# Altium schematic sheet USB.SchDoc
size A4; SheetNumber: 9; SheetTotal: 13
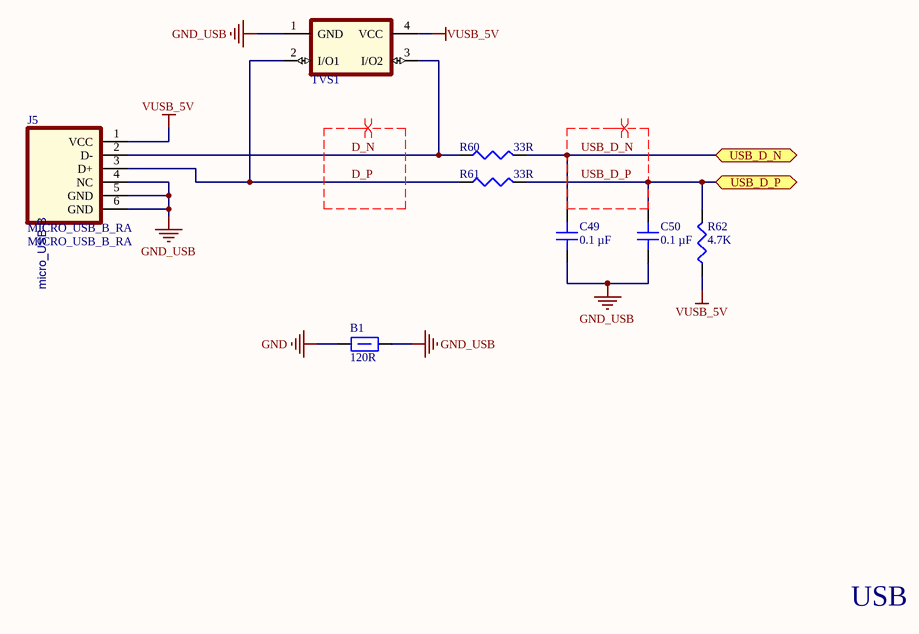
[diagram p0: USB.SchDoc]

## Parts
B1  value 120R  [F0603]  (hidden comment: BEAD FERRITE 120R 1LN SMD 0603)
C49  0.1 µF  [CAP 0603_1608]
C50  0.1 µF  [CAP 0603_1608]
J5  MICRO_USB_B_RA  [MICRO_USB_B]
R60  33R  [R 0603(1608)]
R61  33R  [R 0603(1608)]
R62  4.7K  [R 0603(1608)]
TVS1  TVS DIODE PRTR5V0U2X,215 5.5VWM 6V SOT143  [SOT143]  (value not drawn)

## Ports
USB_D_N (bidir), USB_D_P (bidir)

## Nets
GND: B1.1
GND_USB: B1.2 C49.1 C50.1 J5.4(NC) J5.5(GND) J5.6(GND) TVS1.1(GND)
VUSB_5V: J5.1(VCC) R62.2 TVS1.4(VCC)
D_N: J5.2(D-) R60.2 TVS1.3(I/O2)
D_P: J5.3(D+) R61.2 TVS1.2(I/O1)
USB_D_N: C49.2 R60.1 ; port USB_D_N
USB_D_P: C50.2 R61.1 R62.1 ; port USB_D_P

## Layout directives
differential pair; differential pair class 90ohm: D_N, D_P, USB_D_N, USB_D_P

## Notes on the sheet
- USB
- (in symbol MICRO_USB_B_RA) micro_USB-B

## Library data of the parts
B1 = BEAD FERRITE 120R 1LN SMD 0603: Manufacturer: MURATA; Manufacturer Part Name: BLM18PG121SN1D; Code: 3030007; Family: BEAD; Supplier: Digikey; Supplier No: 490-1037-2-ND; Package Reference: F1206
C49 C50 = 0603BB104K500NGT: CAP CER 0.1UF 50V X7R 0603; Part Number: 0603BB104K500NGT; Value: 0.1 µF
J5 = MICRO_USB_B_RA: CONN MICRO B USB 2.0 RECEPTACLE 5POS SMD RA; Manufacturer: AMPHENOL; Manufacturer Part Name: 10118194-0001LF; Code: 3050016; Family: CONN; Supplier: Digikey; Supplier No: 609-4618-2-ND; Value: MICRO_USB_B_RA
R60 R61 = Res3: Res Thick Film 0603 33 Ohm 1% 1/10W +/-100ppm/ßC Molded SMD Paper T/R; Manufacturer: Yageo; Manufacturer Part Number: RC0603FR-0733RL; Temperature Coefficient: 100ppm/°C; Voltage Rating (DC): 50V; Power Rating: 100mW; Voltage Rating: 75V; ComponentLink1URL: https://datasheet.ciiva.com/11819/0900766b80c66297-11819477.pdf?src-supplier=RSComponents; ComponentLink1Description: https://datasheet.ciiva.com/11819/0900766b80c66297-11819477.pdf?src-supplier=RSComponents; ComponentLink2URL: https://datasheet.ciiva.com/12666/pyu-rc0402-51-rohs-l-6-r-12666741.pdf?src-supplier=Mouser; ComponentLink2Description: https://datasheet.ciiva.com/12666/pyu-rc0402-51-rohs-l-6-r-12666741.pdf?src-supplier=Mouser; ComponentLink3URL: https://datasheet.ciiva.com/17063/pyu-rc0402-51-rohs-l-6-r-17063193.pdf?src-supplier=Future+Electronics; ComponentLink3Description: https://datasheet.ciiva.com/17063/pyu-rc0402-51-rohs-l-6-r-17063193.pdf?src-supplier=Future+Electronics; ComponentLink4URL: https://datasheet.ciiva.com/22747/1018594-22747513.pdf?src-supplier=Element14; ComponentLink4Description: https://datasheet.ciiva.com/22747/1018594-22747513.pdf?src-supplier=Element14; ComponentLink5URL: https://datasheet.ciiva.com/7849/1018594-7849869.pdf?src-supplier=Element14; ComponentLink5Description: https://datasheet.ciiva.com/7849/1018594-7849869.pdf?src-supplier=Element14; ComponentLink6URL: https://datasheet.ciiva.com/7983/1018594-7983502.pdf?src-supplier=Element14; ComponentLink6Description: https://datasheet.ciiva.com/7983/1018594-7983502.pdf?src-supplier=Element14; ComponentLink7URL: https://datasheet.ciiva.com/7849/1018594-7849871.pdf?src-supplier=Element14; ComponentLink7Description: https://datasheet.ciiva.com/7849/1018594-7849871.pdf?src-supplier=Element14; ComponentLink8URL: https://datasheet.ciiva.com/11808/0900766b80c66297-11808195.pdf?src-supplier=RSComponents; ComponentLink8Description: https://datasheet.ciiva.com/11808/0900766b80c66297-11808195.pdf?src-supplier=RSComponents; ComponentLink9URL: https://datasheet.ciiva.com/2452/pyu-rc0402-51-rohs-l-6-2452608.pdf?src-supplier=Digi-Key; ComponentLink9Description: https://datasheet.ciiva.com/2452/pyu-rc0402-51-rohs-l-6-2452608.pdf?src-supplier=Digi-Key; ComponentLink10URL: https://datasheet.ciiva.com/2452/pyu-r-int-thick-7-2452609.pdf?src-supplier=Digi-Key; ComponentLink10Description: https://datasheet.ciiva.com/2452/pyu-r-int-thick-7-2452609.pdf?src-supplier=Digi-Key; ComponentLink11URL: https://datasheet.ciiva.com/2452/pyu-r-int-thick-7-2452610.pdf?src-supplier=Digi-Key; ComponentLink11Description: https://datasheet.ciiva.com/2452/pyu-r-int-thick-7-2452610.pdf?src-supplier=Digi-Key; ComponentLink12URL: https://datasheet.ciiva.com/28386/pyu-rc0402-51-rohs-l-6-28386633.pdf?src-supplier=Avnet+Europe; ComponentLink12Description: https://datasheet.ciiva.com/28386/pyu-rc0402-51-rohs-l-6-28386633.pdf?src-supplier=Avnet+Europe; ComponentLink13URL: https://datasheet.ciiva.com/22747/1018594-22747515.pdf?src-supplier=Element14; ComponentLink13Description: https://datasheet.ciiva.com/22747/1018594-22747515.pdf?src-supplier=Element14; ComponentLink14URL: https://datasheet.ciiva.com/7983/1018594-7983535.pdf?src-supplier=Element14; ComponentLink14Description: https://datasheet.ciiva.com/7983/1018594-7983535.pdf?src-supplier=Element14; ComponentLink15URL: https://datasheet.ciiva.com/8896/pyu-rc0402-51-rohs-l-6-8896201.pdf?src-supplier=Avnet; ComponentLink15Description: https://datasheet.ciiva.com/8896/pyu-rc0402-51-rohs-l-6-8896201.pdf?src-supplier=Avnet; ComponentLink16URL: https://datasheet.ciiva.com/15189/getdatasheetpartid-326379-15189533.pdf?src-supplier=Verical; ComponentLink16Description: https://datasheet.ciiva.com/15189/getdatasheetpartid-326379-15189533.pdf?src-supplier=Verical; Supplier 1: Digi-Key; Supplier Part Number 1: 311-33.0HRCT-ND; RoHS: Yes; Category: Chip SMD Resistors; Stock 1: 1329282; Pricing 1: 1=0,10000, 10=0,02400, 100=0,00970, 1000=0,00436, 2500=0,00378 (USD); Case/Package: 0603; Number of Pins: 2; Case Code (Metric): 1608; Case Code (Imperial): 0603; Weight: 7.1E-05oz; Size Code: 0603; Min Operating Temperature: -55°C; Max Operating Temperature: 155°C; Resistance: 33R; Tolerance: 1%; Resistor Type: Thick Film; Packaging: Tape and Reel; Package Quantity: 1; Number of Terminations: 2; Termination: SMD/SMT; Max Power Dissipation: 100mW; Features: Moisture Resistant; Series: RC; Resistance Tolerance: 1%; Technology: THICK FILM; Construction: Rectangular; Length: 1.6mm; Width: 0.8mm; Height: 0.45mm; Depth: 0.8mm; Lead Pitch: 0.3mm; REACH SVHC: No SVHC; Lead Free: Lead Free; Military Standard: Not; RoHS Compliant: Yes; ComponentLink17URL: https://datasheet.ciiva.com/11808/0900766b80f96399-11808741.pdf?src-supplier=RSComponents; ComponentLink17Description: https://datasheet.ciiva.com/11808/0900766b80f96399-11808741.pdf?src-supplier=RSComponents; ComponentLink18URL: https://datasheet.ciiva.com/2453/pyu-r-int-thick-7-2453952.pdf?src-supplier=Digi-Key; ComponentLink18Description: https://datasheet.ciiva.com/2453/pyu-r-int-thick-7-2453952.pdf?src-supplier=Digi-Key; ComponentLink19URL: https://datasheet.ciiva.com/2453/pyu-r-int-thick-7-2453953.pdf?src-supplier=Digi-Key; ComponentLink19Description: https://datasheet.ciiva.com/2453/pyu-r-int-thick-7-2453953.pdf?src-supplier=Digi-Key; ComponentLink20URL: https://datasheet.ciiva.com/2453/pyu-r-int-thick-7-2453954.pdf?src-supplier=Digi-Key; ComponentLink20Description: https://datasheet.ciiva.com/2453/pyu-r-int-thick-7-2453954.pdf?src-supplier=Digi-Key; ComponentLink21URL: https://datasheet.ciiva.com/7660/38590-7660792.pdf?src-supplier=Element14; ComponentLink21Description: https://datasheet.ciiva.com/7660/38590-7660792.pdf?src-supplier=Element14; ComponentLink22URL: https://datasheet.ciiva.com/15189/getdatasheetpartid-326673-15189708.pdf?src-supplier=Verical; ComponentLink22Description: https://datasheet.ciiva.com/15189/getdatasheetpartid-326673-15189708.pdf?src-supplier=Verical; ComponentLink23URL: https://datasheet.ciiva.com/7746/443971-7746334.pdf?src-supplier=Element14; ComponentLink23Description: https://datasheet.ciiva.com/7746/443971-7746334.pdf?src-supplier=Element14; ComponentLink24URL: https://datasheet.ciiva.com/7746/443971-7746335.pdf?src-supplier=Element14; ComponentLink24Description: https://datasheet.ciiva.com/7746/443971-7746335.pdf?src-supplier=Element14; ComponentLink25URL: https://datasheet.ciiva.com/46395/443971-46395007.pdf?src-supplier=Element14; ComponentLink25Description: https://datasheet.ciiva.com/46395/443971-46395007.pdf?src-supplier=Element14
R62 = Res3: Res Thick Film 0603 4.7K Ohm 5% 0.1W(1/10W) ±100ppm/C Molded SMD Paper T/R; Manufacturer: Yageo; Manufacturer Part Number: RC0603JR-074K7L; Resistance: 4.7kR; Temperature Coefficient: 100ppm/°C; Voltage Rating (DC): 50V; Power Rating: 100mW; ComponentLink1URL: https://datasheet.ciiva.com/11819/0900766b80c66297-11819477.pdf?src-supplier=RSComponents; ComponentLink1Description: https://datasheet.ciiva.com/11819/0900766b80c66297-11819477.pdf?src-supplier=RSComponents; ComponentLink2URL: https://datasheet.ciiva.com/12666/pyu-rc0402-51-rohs-l-6-r-12666741.pdf?src-supplier=Mouser; ComponentLink2Description: https://datasheet.ciiva.com/12666/pyu-rc0402-51-rohs-l-6-r-12666741.pdf?src-supplier=Mouser; ComponentLink3URL: https://datasheet.ciiva.com/17063/pyu-rc0402-51-rohs-l-6-r-17063193.pdf?src-supplier=Future+Electronics; ComponentLink3Description: https://datasheet.ciiva.com/17063/pyu-rc0402-51-rohs-l-6-r-17063193.pdf?src-supplier=Future+Electronics; ComponentLink4URL: https://datasheet.ciiva.com/22747/1018594-22747513.pdf?src-supplier=Element14; ComponentLink4Description: https://datasheet.ciiva.com/22747/1018594-22747513.pdf?src-supplier=Element14; ComponentLink5URL: https://datasheet.ciiva.com/7849/1018594-7849869.pdf?src-supplier=Element14; ComponentLink5Description: https://datasheet.ciiva.com/7849/1018594-7849869.pdf?src-supplier=Element14; ComponentLink6URL: https://datasheet.ciiva.com/7983/1018594-7983502.pdf?src-supplier=Element14; ComponentLink6Description: https://datasheet.ciiva.com/7983/1018594-7983502.pdf?src-supplier=Element14; ComponentLink7URL: https://datasheet.ciiva.com/7849/1018594-7849871.pdf?src-supplier=Element14; ComponentLink7Description: https://datasheet.ciiva.com/7849/1018594-7849871.pdf?src-supplier=Element14; ComponentLink8URL: https://datasheet.ciiva.com/11808/0900766b80c66297-11808195.pdf?src-supplier=RSComponents; ComponentLink8Description: https://datasheet.ciiva.com/11808/0900766b80c66297-11808195.pdf?src-supplier=RSComponents; ComponentLink9URL: https://datasheet.ciiva.com/2452/pyu-rc0402-51-rohs-l-6-2452608.pdf?src-supplier=Digi-Key; ComponentLink9Description: https://datasheet.ciiva.com/2452/pyu-rc0402-51-rohs-l-6-2452608.pdf?src-supplier=Digi-Key; ComponentLink10URL: https://datasheet.ciiva.com/2452/pyu-r-int-thick-7-2452609.pdf?src-supplier=Digi-Key; ComponentLink10Description: https://datasheet.ciiva.com/2452/pyu-r-int-thick-7-2452609.pdf?src-supplier=Digi-Key; ComponentLink11URL: https://datasheet.ciiva.com/2452/pyu-r-int-thick-7-2452610.pdf?src-supplier=Digi-Key; ComponentLink11Description: https://datasheet.ciiva.com/2452/pyu-r-int-thick-7-2452610.pdf?src-supplier=Digi-Key; ComponentLink12URL: https://datasheet.ciiva.com/28386/pyu-rc0402-51-rohs-l-6-28386633.pdf?src-supplier=Avnet+Europe; ComponentLink12Description: https://datasheet.ciiva.com/28386/pyu-rc0402-51-rohs-l-6-28386633.pdf?src-supplier=Avnet+Europe; ComponentLink13URL: https://datasheet.ciiva.com/22747/1018594-22747515.pdf?src-supplier=Element14; ComponentLink13Description: https://datasheet.ciiva.com/22747/1018594-22747515.pdf?src-supplier=Element14; ComponentLink14URL: https://datasheet.ciiva.com/7983/1018594-7983535.pdf?src-supplier=Element14; ComponentLink14Description: https://datasheet.ciiva.com/7983/1018594-7983535.pdf?src-supplier=Element14; ComponentLink15URL: https://datasheet.ciiva.com/8896/pyu-rc0402-51-rohs-l-6-8896201.pdf?src-supplier=Avnet; ComponentLink15Description: https://datasheet.ciiva.com/8896/pyu-rc0402-51-rohs-l-6-8896201.pdf?src-supplier=Avnet; ComponentLink16URL: https://datasheet.ciiva.com/15189/getdatasheetpartid-326379-15189533.pdf?src-supplier=Verical; ComponentLink16Description: https://datasheet.ciiva.com/15189/getdatasheetpartid-326379-15189533.pdf?src-supplier=Verical; ComponentLink17URL: https://datasheet.ciiva.com/11808/0900766b80f96399-11808741.pdf?src-supplier=RSComponents; ComponentLink17Description: https://datasheet.ciiva.com/11808/0900766b80f96399-11808741.pdf?src-supplier=RSComponents; ComponentLink18URL: https://datasheet.ciiva.com/2453/pyu-r-int-thick-7-2453952.pdf?src-supplier=Digi-Key; ComponentLink18Description: https://datasheet.ciiva.com/2453/pyu-r-int-thick-7-2453952.pdf?src-supplier=Digi-Key; ComponentLink19URL: https://datasheet.ciiva.com/2453/pyu-r-int-thick-7-2453953.pdf?src-supplier=Digi-Key; ComponentLink19Description: https://datasheet.ciiva.com/2453/pyu-r-int-thick-7-2453953.pdf?src-supplier=Digi-Key; ComponentLink20URL: https://datasheet.ciiva.com/2453/pyu-r-int-thick-7-2453954.pdf?src-supplier=Digi-Key; ComponentLink20Description: https://datasheet.ciiva.com/2453/pyu-r-int-thick-7-2453954.pdf?src-supplier=Digi-Key; ComponentLink21URL: https://datasheet.ciiva.com/7660/38590-7660792.pdf?src-supplier=Element14; ComponentLink21Description: https://datasheet.ciiva.com/7660/38590-7660792.pdf?src-supplier=Element14; ComponentLink22URL: https://datasheet.ciiva.com/15189/getdatasheetpartid-326673-15189708.pdf?src-supplier=Verical; ComponentLink22Description: https://datasheet.ciiva.com/15189/getdatasheetpartid-326673-15189708.pdf?src-supplier=Verical; ComponentLink23URL: https://datasheet.ciiva.com/7746/443971-7746334.pdf?src-supplier=Element14; ComponentLink23Description: https://datasheet.ciiva.com/7746/443971-7746334.pdf?src-supplier=Element14; ComponentLink24URL: https://datasheet.ciiva.com/7746/443971-7746335.pdf?src-supplier=Element14; ComponentLink24Description: https://datasheet.ciiva.com/7746/443971-7746335.pdf?src-supplier=Element14; ComponentLink25URL: https://datasheet.ciiva.com/46395/443971-46395007.pdf?src-supplier=Element14; ComponentLink25Description: https://datasheet.ciiva.com/46395/443971-46395007.pdf?src-supplier=Element14; ComponentLink26URL: https://datasheet.ciiva.com/15189/getdatasheetpartid-422754-15189760.pdf?src-supplier=Verical; ComponentLink26Description: https://datasheet.ciiva.com/15189/getdatasheetpartid-422754-15189760.pdf?src-supplier=Verical; ComponentLink27URL: https://datasheet.ciiva.com/22747/443971-22747528.pdf?src-supplier=Element14; ComponentLink27Description: https://datasheet.ciiva.com/22747/443971-22747528.pdf?src-supplier=Element14; ComponentLink28URL: https://datasheet.ciiva.com/7660/38590-7660794.pdf?src-supplier=Element14; ComponentLink28Description: https://datasheet.ciiva.com/7660/38590-7660794.pdf?src-supplier=Element14; ComponentLink29URL: https://datasheet.ciiva.com/7746/1868787-7746365.pdf?src-supplier=Element14; ComponentLink29Description: https://datasheet.ciiva.com/7746/1868787-7746365.pdf?src-supplier=Element14; ComponentLink30URL: https://datasheet.ciiva.com/46440/1868787-46440909.pdf?src-supplier=Element14; ComponentLink30Description: https://datasheet.ciiva.com/46440/1868787-46440909.pdf?src-supplier=Element14; ComponentLink31URL: https://datasheet.ciiva.com/7746/1738695-7746366.pdf?src-supplier=Element14; ComponentLink31Description: https://datasheet.ciiva.com/7746/1738695-7746366.pdf?src-supplier=Element14; Supplier 1: Digi-Key; Supplier Part Number 1: 311-4.7KGRCT-ND; RoHS: Yes; Category: Chip SMD Resistors; Stock 1: 1931744; Pricing 1: 1=0,10000, 10=0,02000, 100=0,00800, 1000=0,00360, 2500=0,00312 (USD); Case/Package: 0603; Number of Pins: 2; Case Code (Imperial): 0603; Case Code (Metric): 1608; Size Code: 0603; Min Operating Temperature: -55°C; Max Operating Temperature: 155°C; Resistor Type: Thick Film; Tolerance: 5%; Packaging: Tape and Reel; Voltage Rating: 50V; Termination: SMD/SMT; Features: Moisture Resistant; Max Power Dissipation: 100mW; Number of Terminations: 2; Series: RC; Resistance Tolerance: 5%; Construction: Rectangular; Length: 1.6mm; Width: 0.8mm; Depth: 0.8mm; REACH SVHC: No SVHC; Lead Free: Lead Free; RoHS Compliant: Yes; Military Standard: Not; ComponentLink32URL: https://datasheet.ciiva.com/46412/443971-46412858.pdf?src-supplier=Element14; ComponentLink32Description: https://datasheet.ciiva.com/46412/443971-46412858.pdf?src-supplier=Element14
TVS1 = TVS DIODE PRTR5V0U2X,215 5.5VWM 6V SOT143: Manufacturer: NXP SEMI; Code: 3040037; Family: DIODE; Manufacturer Part Name: PRTR5V0U2X,215; Package Reference: SOT143; Supplier: Digikey; Supplier No: 568-4140-1-ND; Value: PRTR5V0U2X